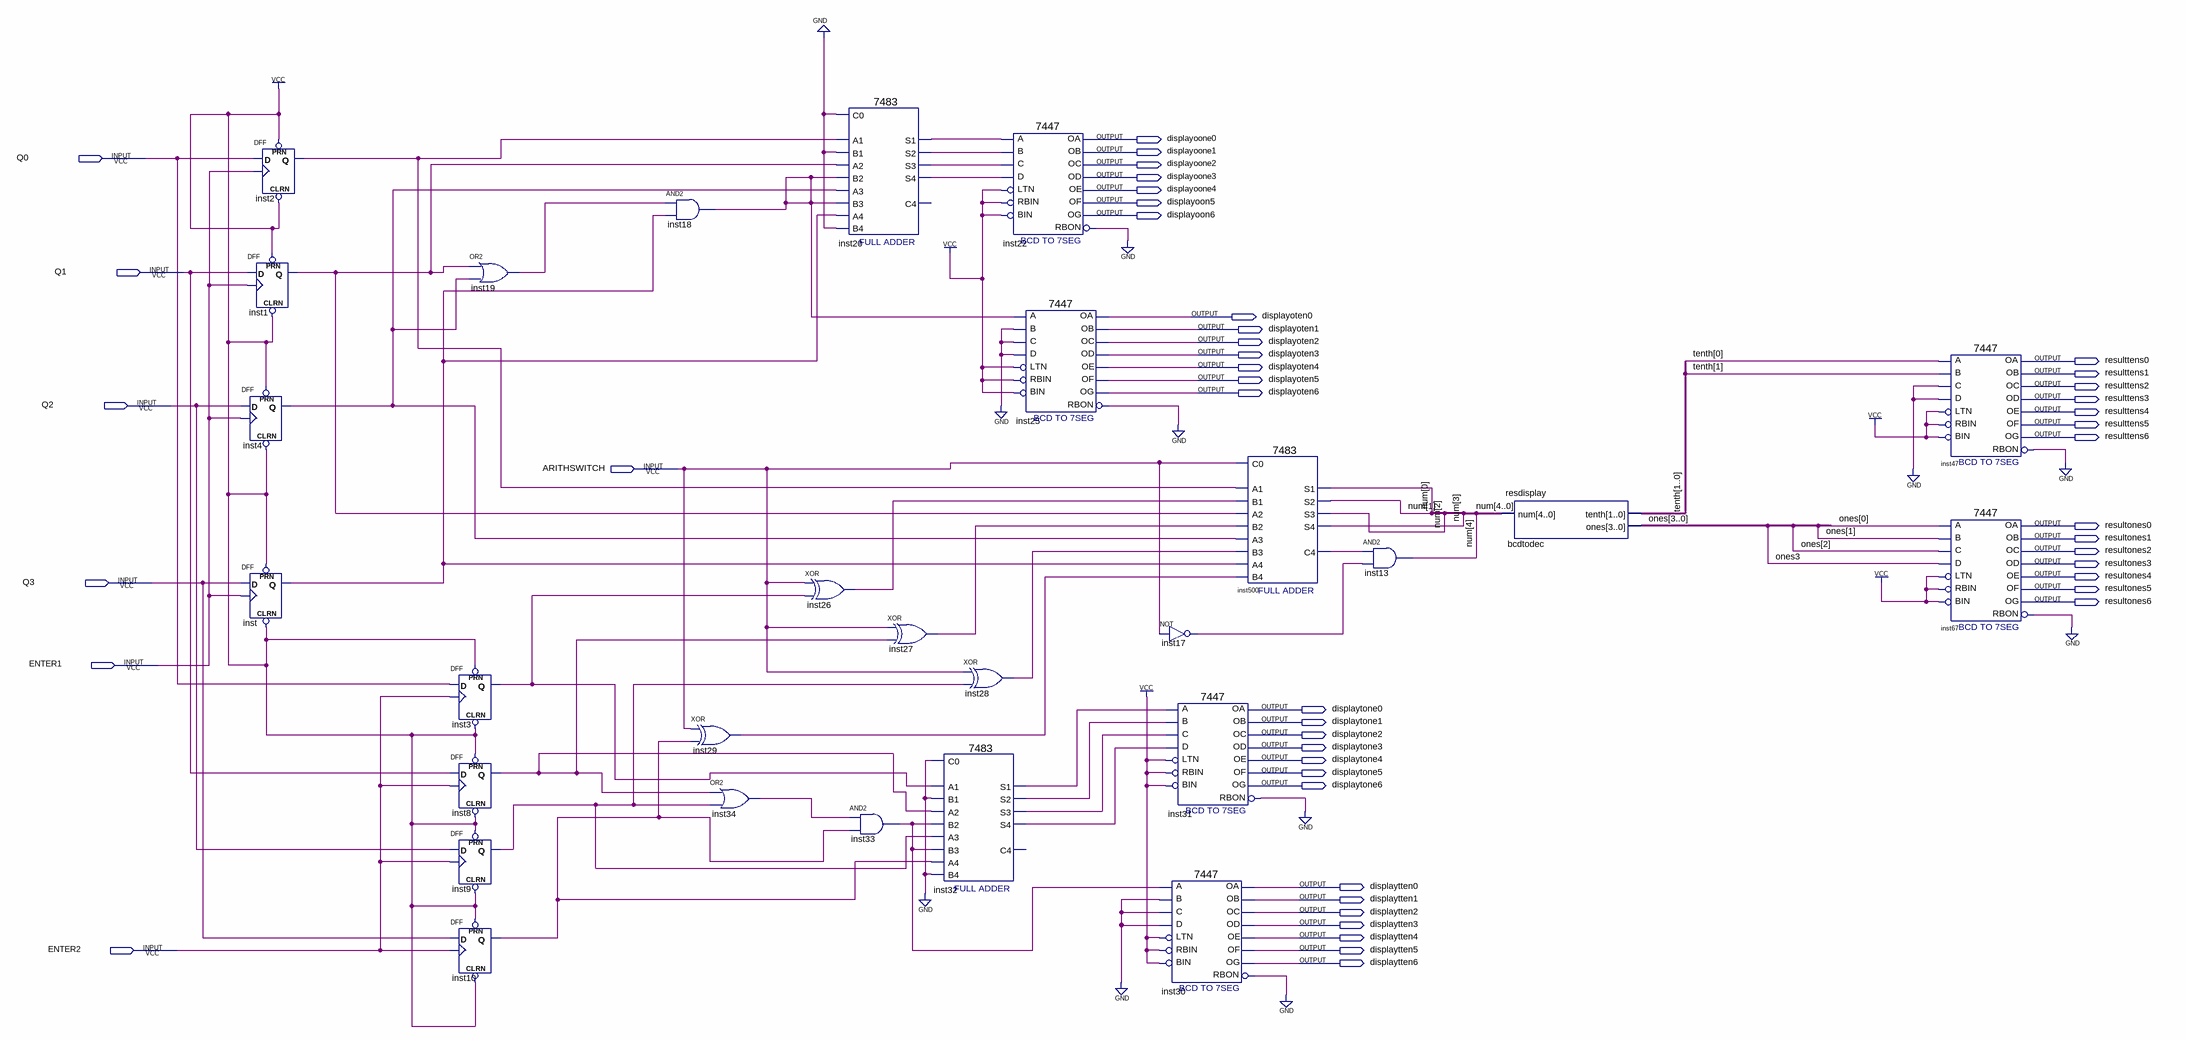
[diagram p0: schematic sheet]
// Quartus schematic numdispmayb.bdf as structural Verilog: 28 symbols, 49 pins
module numdispmayb (
  input  Q0,
  input  Q1,
  input  Q2,
  input  ARITHSWITCH,
  input  Q3,
  input  ENTER1,
  input  ENTER2,
  output displayoone0,
  output displayoone1,
  output displayoone2,
  output displayoone3,
  output displayoone4,
  output displayoon5,
  output displayoon6,
  output displayoten0,
  output displayoten1,
  output displayoten2,
  output displayoten3,
  output resulttens0,
  output displayoten4,
  output resulttens1,
  output displayoten5,
  output resulttens2,
  output displayoten6,
  output resulttens3,
  output resulttens4,
  output resulttens5,
  output resulttens6,
  output resultones0,
  output resultones1,
  output resultones2,
  output resultones3,
  output resultones4,
  output resultones5,
  output resultones6,
  output displaytone0,
  output displaytone1,
  output displaytone2,
  output displaytone3,
  output displaytone4,
  output displaytone5,
  output displaytone6,
  output displaytten0,
  output displaytten1,
  output displaytten2,
  output displaytten3,
  output displaytten4,
  output displaytten5,
  output displaytten6
);

  wire inst1_q, inst2_q, inst3_q, inst4_q, inst8_q, inst9_q, inst10_q, inst17_out, inst18_out, inst19_out,
       inst20_s1, inst20_s2, inst20_s3, inst20_s4, inst22_rbon, inst25_rbon, inst26_out, inst27_out,
       inst28_out, inst29_out, inst30_rbon, inst31_rbon, inst32_s1, inst32_s2, inst32_s3, inst32_s4,
       inst33_out, inst34_out, inst47_rbon, inst67_rbon, inst500_c4, inst_q;
  wire [1:0] tenth;
  wire [3:0] ones;
  wire [4:0] num;

  DFF inst2 (.CLRN(1'b1), .CLK(ENTER1), .D(Q0), .PRN(1'b1), .Q(inst2_q));
  DFF inst1 (.CLRN(1'b1), .CLK(ENTER1), .D(Q1), .PRN(1'b1), .Q(inst1_q));
  DFF inst4 (.CLRN(1'b1), .CLK(ENTER1), .D(Q2), .PRN(1'b1), .Q(inst4_q));
  DFF inst (.CLRN(1'b1), .CLK(ENTER1), .D(Q3), .PRN(1'b1), .Q(inst_q));
  or inst19 (inst19_out, inst1_q, inst4_q);
  DFF inst3 (.CLRN(1'b1), .CLK(ENTER2), .D(Q0), .PRN(1'b1), .Q(inst3_q));
  DFF inst8 (.CLRN(1'b1), .CLK(ENTER2), .D(Q1), .PRN(1'b1), .Q(inst8_q));
  DFF inst9 (.CLRN(1'b1), .CLK(ENTER2), .D(Q2), .PRN(1'b1), .Q(inst9_q));
  DFF inst10 (.CLRN(1'b1), .CLK(ENTER2), .D(Q3), .PRN(1'b1), .Q(inst10_q));
  and inst18 (inst18_out, inst19_out, inst_q);
  xor inst29 (inst29_out, ARITHSWITCH, inst10_q);
  or inst34 (inst34_out, inst8_q, inst9_q);
  xor inst26 (inst26_out, ARITHSWITCH, inst3_q);
  \7483  inst20 (
    .B4(1'b0), .C0(1'b0), .A1(inst2_q), .A2(inst1_q), .B1(1'b0), .B2(inst18_out), .A3(inst4_q),
    .B3(inst18_out), .A4(inst_q), .S3(inst20_s3), .S4(inst20_s4), .S2(inst20_s2), .S1(inst20_s1));  // open: C4
  and inst33 (inst33_out, inst34_out, inst10_q);
  xor inst27 (inst27_out, ARITHSWITCH, inst8_q);
  \7483  inst32 (
    .B4(1'b0), .C0(1'b0), .A1(inst3_q), .A2(inst8_q), .B1(1'b0), .B2(inst33_out), .A3(inst9_q),
    .B3(inst33_out), .A4(inst10_q), .S3(inst32_s3), .S4(inst32_s4), .S2(inst32_s2), .S1(inst32_s1));  // open: C4
  xor inst28 (inst28_out, ARITHSWITCH, inst9_q);
  \7447  inst22 (
    .LTN(1'b1), .B(inst20_s2), .C(inst20_s3), .D(inst20_s4), .RBIN(1'b1), .BIN(1'b1), .A(inst20_s1),
    .OB(displayoone1), .OC(displayoone2), .OE(displayoone4), .OD(displayoone3), .OF(displayoon5),
    .OG(displayoon6), .OA(displayoone0), .RBON(inst22_rbon));
  \7447  inst25 (
    .LTN(1'b1), .B(1'b0), .C(1'b0), .D(1'b0), .RBIN(1'b1), .BIN(1'b1), .A(inst18_out), .OB(displayoten1),
    .OC(displayoten2), .OE(displayoten4), .OD(displayoten3), .OF(displayoten5), .OG(displayoten6),
    .OA(displayoten0), .RBON(inst25_rbon));
  not inst17 (inst17_out, ARITHSWITCH);
  \7447  inst31 (
    .LTN(1'b1), .B(inst32_s2), .C(inst32_s3), .D(inst32_s4), .RBIN(1'b1), .BIN(1'b1), .A(inst32_s1),
    .OB(displaytone1), .OC(displaytone2), .OE(displaytone4), .OD(displaytone3), .OF(displaytone5),
    .OG(displaytone6), .OA(displaytone0), .RBON(inst31_rbon));
  \7447  inst30 (
    .LTN(1'b1), .B(1'b0), .C(1'b0), .D(1'b0), .RBIN(1'b1), .BIN(1'b1), .A(inst33_out), .OB(displaytten1),
    .OC(displaytten2), .OE(displaytten4), .OD(displaytten3), .OF(displaytten5), .OG(displaytten6),
    .OA(displaytten0), .RBON(inst30_rbon));
  \7483  inst500 (
    .B4(inst29_out), .C0(ARITHSWITCH), .A1(inst2_q), .A2(inst1_q), .B1(inst26_out), .B2(inst27_out),
    .A3(inst4_q), .B3(inst28_out), .A4(inst_q), .S3(num[2]), .S4(num[3]), .S2(num[1]), .C4(inst500_c4),
    .S1(num[0]));
  and inst13 (num[4], inst500_c4, inst17_out);
  resdisplay bcdtodec (.num(num), .tenth(tenth), .ones(ones));
  \7447  inst47 (
    .LTN(1'b1), .B(tenth[1]), .C(1'b0), .D(1'b0), .RBIN(1'b1), .BIN(1'b1), .A(tenth[0]), .OB(resulttens1),
    .OC(resulttens2), .OE(resulttens4), .OD(resulttens3), .OF(resulttens5), .OG(resulttens6),
    .OA(resulttens0), .RBON(inst47_rbon));
  \7447  inst67 (
    .LTN(1'b1), .B(ones[1]), .C(ones[2]), .D(ones[3]), .RBIN(1'b1), .BIN(1'b1), .A(ones[0]),
    .OB(resultones1), .OC(resultones2), .OE(resultones4), .OD(resultones3), .OF(resultones5),
    .OG(resultones6), .OA(resultones0), .RBON(inst67_rbon));
  // also tied to GND on the sheet: {inst22_rbon, inst25_rbon, inst30_rbon, inst31_rbon, inst67_rbon, inst47_rbon}
endmodule
